# EasyEDA schematic SCH_VTOL-FC_2024-12-10.json
TITLE: VTOL FC; REV: 1.0.0; Sheet: 1/1
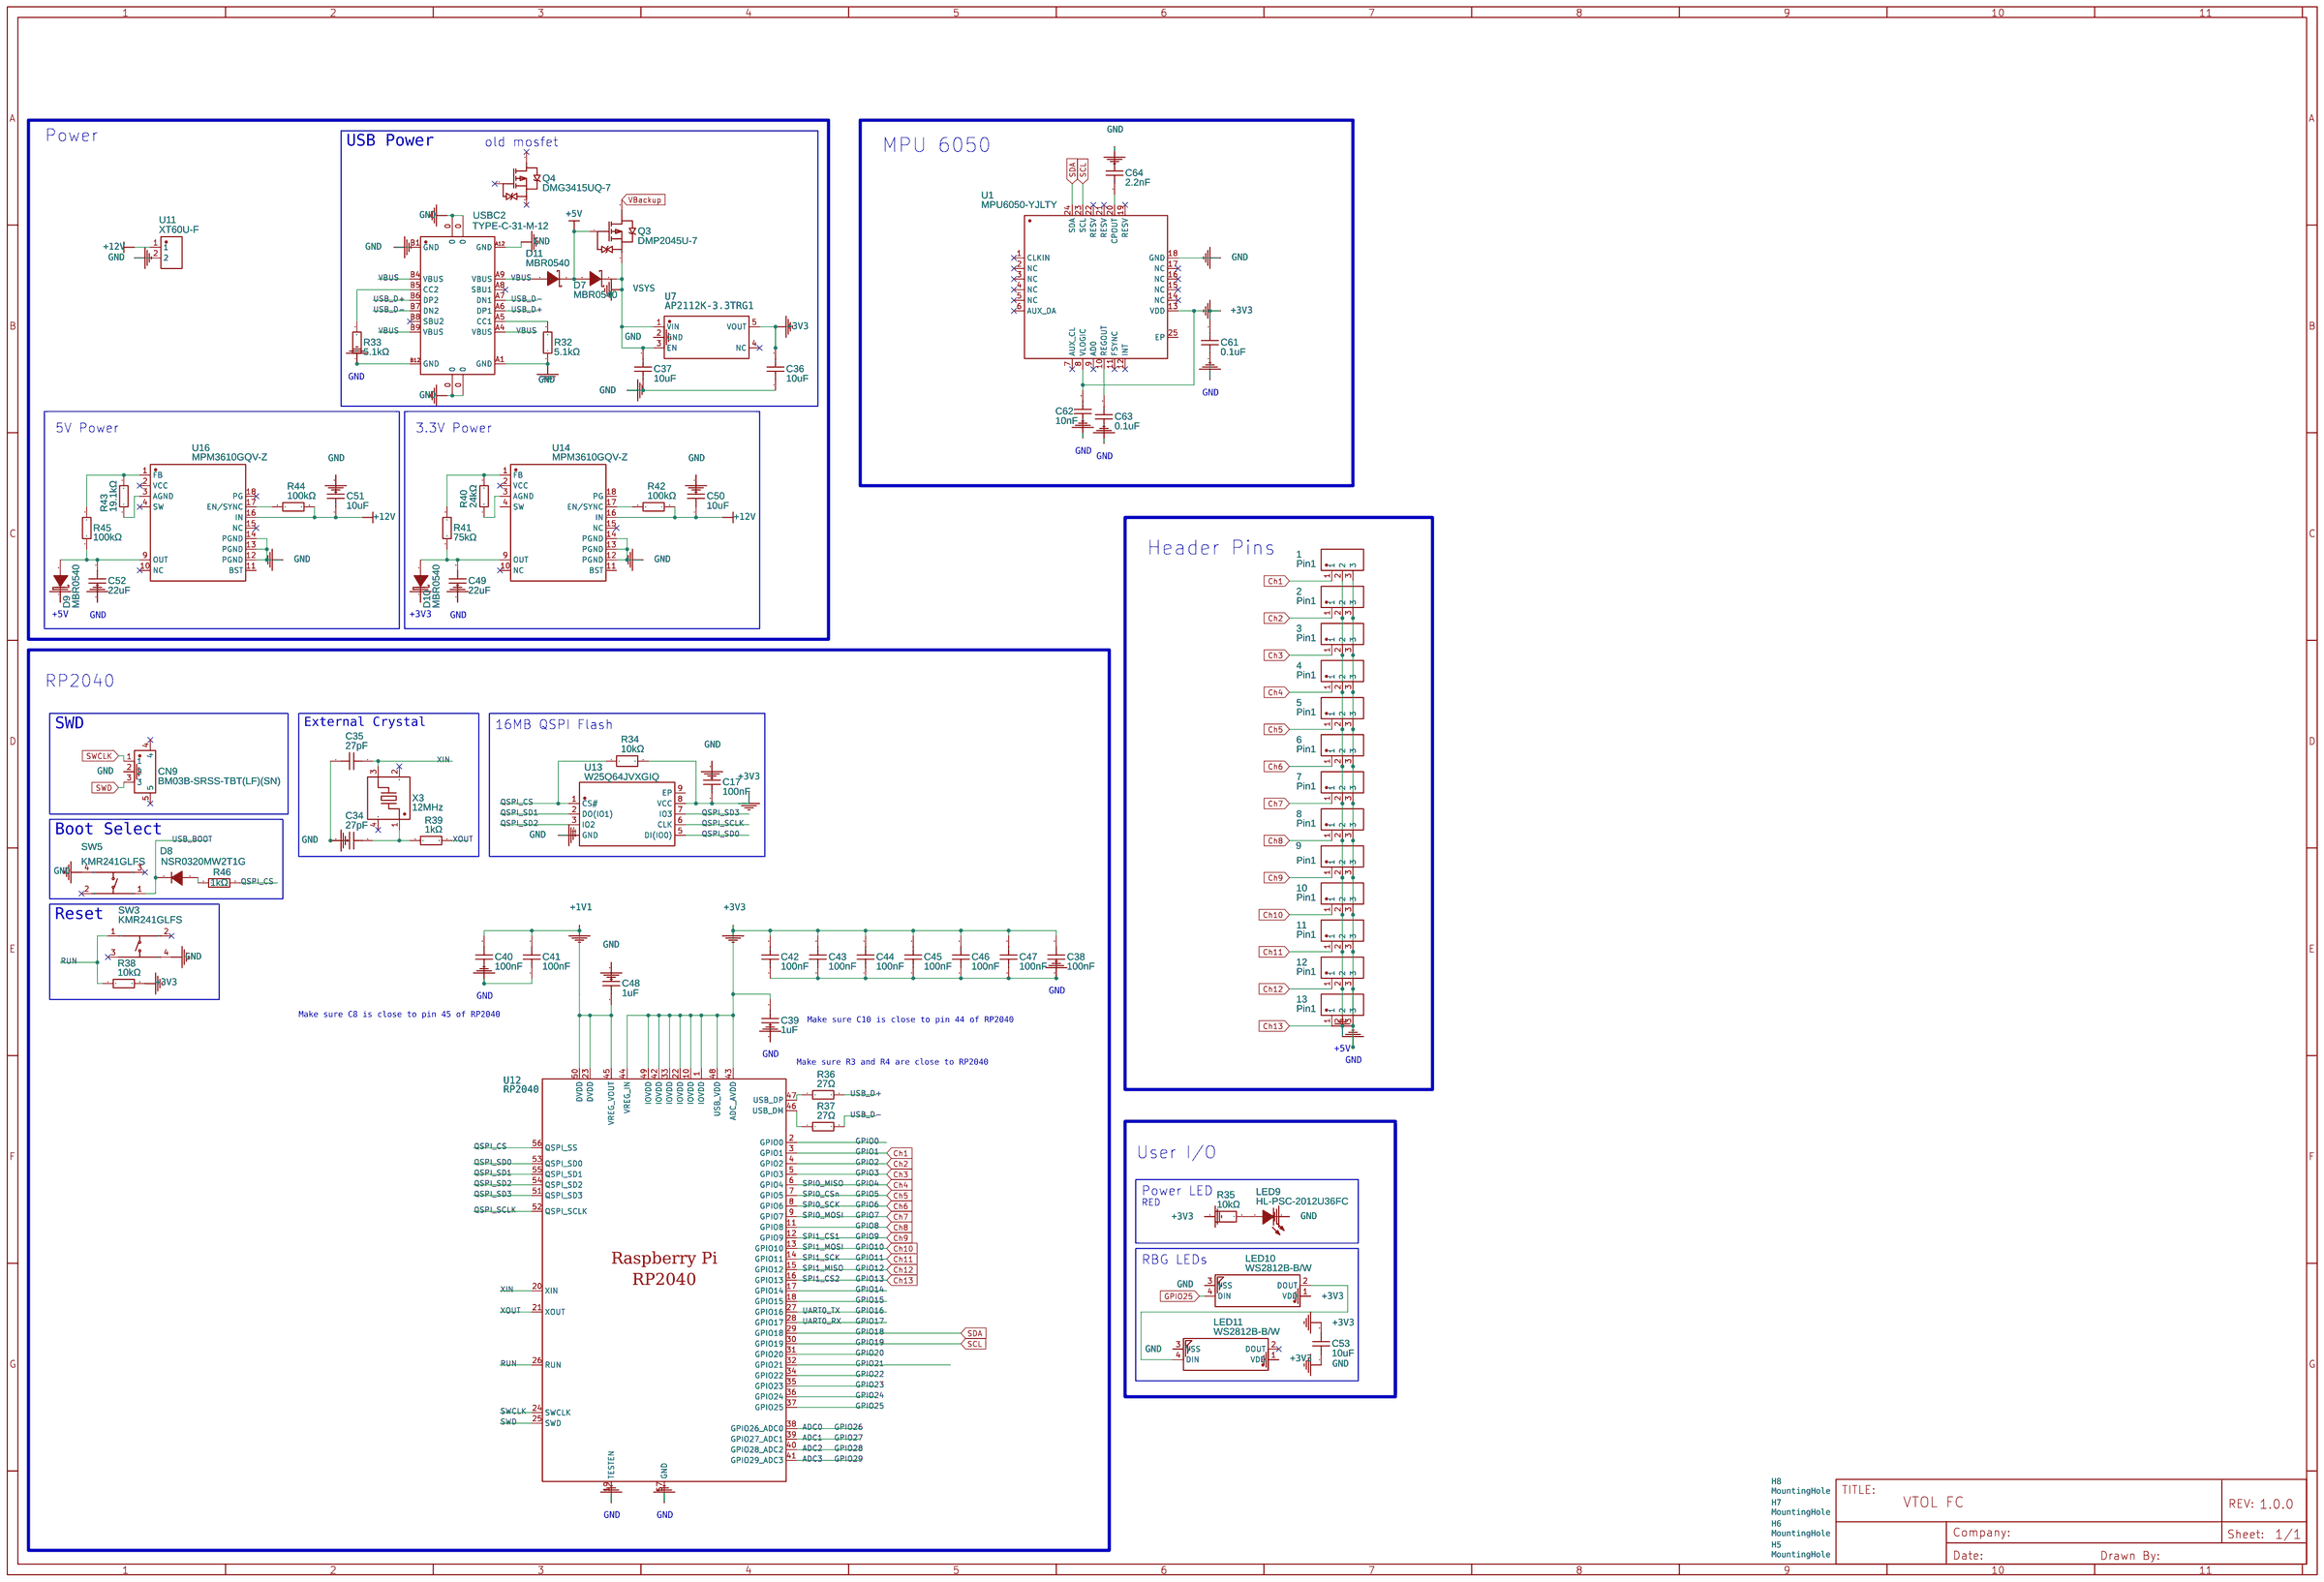
[diagram p0: schematic sheet]

## Parts
1  Pin1  [HDR-TH_3P-P2.54-V-M]
2  Pin1  [HDR-TH_3P-P2.54-V-M]
3  Pin1  [HDR-TH_3P-P2.54-V-M]
4  Pin1  [HDR-TH_3P-P2.54-V-M]
5  Pin1  [HDR-TH_3P-P2.54-V-M]
6  Pin1  [HDR-TH_3P-P2.54-V-M]
7  Pin1  [HDR-TH_3P-P2.54-V-M]
8  Pin1  [HDR-TH_3P-P2.54-V-M]
9  Pin1  [HDR-TH_3P-P2.54-V-M]
10  Pin1  [HDR-TH_3P-P2.54-V-M]
11  Pin1  [HDR-TH_3P-P2.54-V-M]
12  Pin1  [HDR-TH_3P-P2.54-V-M]
13  Pin1  [HDR-TH_3P-P2.54-V-M]
C17  100nF  [C0402]
C34  27pF  [C0402]
C35  27pF  [C0402]
C36  10uF  [C0603]
C37  10uF  [C0603]
C38  100nF  [C0402]
C39  1uF  [C0402]
C40  100nF  [C0402]
C41  100nF  [C0402]
C42  100nF  [C0402]
C43  100nF  [C0402]
C44  100nF  [C0402]
C45  100nF  [C0402]
C46  100nF  [C0402]
C47  100nF  [C0402]
C48  1uF  [C0402]
C49  22uF  [C0603]
C50  10uF  [C0603]
C51  10uF  [C0603]
C52  22uF  [C0603]
C53  10uF  [C0603]
C61  0.1uF  [C0603]
C62  10nF  [C0603]
C63  0.1uF  [C0603]
C64  2.2nF  [C0603]
CN9  BM03B-SRSS-TBT(LF)(SN)  [CONN-SMD_BM03B-SRSS-TBT-LF-SN]
D7  MBR0540  [SOD-123FL_L2.7-W1.8-LS3.8-RD]
D8  NSR0320MW2T1G  [SOD-323_L1.8-W1.3-LS2.5-RD]
D9  MBR0540  [SOD-123FL_L2.7-W1.8-LS3.8-RD]
D10  MBR0540  [SOD-123FL_L2.7-W1.8-LS3.8-RD]
D11  MBR0540  [SOD-123FL_L2.7-W1.8-LS3.8-RD]
H5  MountingHole  [MOUNTINGHOLE_2.7MM_M2.5]
H6  MountingHole  [MOUNTINGHOLE_2.7MM_M2.5]
H7  MountingHole  [MOUNTINGHOLE_2.7MM_M2.5]
H8  MountingHole  [MOUNTINGHOLE_2.7MM_M2.5]
LED9  HL-PSC-2012U36FC  [LED0805-RD_RED]
LED10  WS2812B-B/W  [LED-SMD_4P-L5.0-W5.0-TL_WS2812B-B]
LED11  WS2812B-B/W  [LED-SMD_4P-L5.0-W5.0-TL_WS2812B-B]
Q3  DMP2045U-7  [SOT-23-3_L2.9-W1.3-P1.90-LS2.4-BR-CW]
Q4  DMG3415UQ-7  [SOT-23-3_L2.9-W1.6-P1.90-LS2.8-BR]
R32  5.1kΩ  [R0603]
R33  5.1kΩ  [R0603]
R34  10kΩ  [R0603]
R35  10kΩ  [R0603]
R36  27Ω  [R0402]
R37  27Ω  [R0402]
R38  10kΩ  [R0603]
R39  1kΩ  [R0603]
R40  24kΩ  [R0603]
R41  75kΩ  [R0603]
R42  100kΩ  [R0603]
R43  19.1kΩ  [R0603]
R44  100kΩ  [R0603]
R45  100kΩ  [R0603]
R46  1kΩ  [R0603]
SW3  KMR241GLFS  [KEY-SMD_4P-L4.2-W2.8-P1.60-LS4.6]
SW5  KMR241GLFS  [KEY-SMD_4P-L4.2-W2.8-P1.60-LS4.6]
U1  MPU6050-YJLTY  [QFN-24_L4.0-W4.0-P0.50-BL-EP2.7]
U7  AP2112K-3.3TRG1  [SOT-25-5_L3.0-W1.8-P0.95-LS3.0-BR]
U11  XT60U-F  [CONN-TH_XT60U-F]
U12  RP2040  [LQFN-56_L7.0-W7.0-P0.4-EP]
U13  W25Q64JVXGIQ  [XSON-8_L4.0-W4.0-P0.80-TL-EP]
U14  MPM3610GQV-Z  [QFN-20_L5.0-W3.0-TL-MPM3610GQV-Z]
U16  MPM3610GQV-Z  [QFN-20_L5.0-W3.0-TL-MPM3610GQV-Z]
USBC2  TYPE-C-31-M-12  [USB-C_SMD-TYPE-C-31-M-12]
X3  12MHz  [CRYSTAL-SMD_4P-L3.2-W2.5-BL]

## Library data of the parts
1-13 = 5-146277-3: Supplier: LCSC; Supplier Part: C3327863; Manufacturer: TE Connectivity(泰科电子); Contributor: lcsc
C17 C38 C40-C47 = GCM155R71C104KA55D: Supplier: LCSC; Manufacturer: muRata(村田); Supplier Part: C85857; JLCPCB Part Class: Extended Part
C34 C35 = GJM1555C1H270JB01D: Supplier: LCSC; Manufacturer: muRata(村田); Supplier Part: C88884; JLCPCB Part Class: Extended Part
C36 C37 C50 C51 C53 = CSA0603X5R106M6R3JT: Contributor: lcsc; Supplier: LCSC; Supplier Part: C3015157; Manufacturer: HRE(芯声); JLCPCB Part Class: Extended Part
C39 C48 = TCC0402X5R105K100AT: Contributor: LCSC; Supplier: LCSC; Supplier Part: C380293; Manufacturer: CCTC(三环); JLCPCB Part Class: Extended Part
C49 C52 = CL10A226MQ8NRNC: Supplier: LCSC; Manufacturer: SAMSUNG(三星); Supplier Part: C59461; JLCPCB Part Class: Basic Part
C61-C64 = 0603_C9900021180: Contributor: lcsc; Supplier: LCSC; Supplier Part: C9900021180; Manufacturer: null; Manufacturer Part: 0603; JLCPCB Part Class: Extended Part
CN9 = BM03B-SRSS-TBT(LF)(SN): Contributor: LCSC; Supplier: LCSC; Supplier Part: C495538; Manufacturer: JST; JLCPCB Part Class: Extended Part
D7 D9-D11 = MBR0540: Contributor: LCSC; Supplier: LCSC; Supplier Part: C116159; Manufacturer: SHIKUES(时科); JLCPCB Part Class: Extended Part
D8 = NSR0320MW2T1G: Supplier: LCSC; Manufacturer: onsemi(安森美); Supplier Part: C48192; JLCPCB Part Class: Extended Part
LED9 = HL-PSC-2012U36FC: Contributor: LCSC; Supplier: LCSC; Supplier Part: C497949; Manufacturer: HONGLITRONIC(鸿利光电); JLCPCB Part Class: Extended Part
LED10 LED11 = WS2812B-B/W: Contributor: LCSC; Supplier: LCSC; Supplier Part: C2761795; Manufacturer: worldsemi; Manufacturer Part: WS2812B-B/T; JLCPCB Part Class: Extended Part
Q3 = DMP2045U-7: Contributor: LCSC; Supplier: LCSC; Supplier Part: C459541; Manufacturer: DIODES(美台); JLCPCB Part Class: Extended Part
Q4 = DMG3415UQ-7: Contributor: LCSC; Supplier: LCSC; Supplier Part: C459537; Manufacturer: DIODES(美台); JLCPCB Part Class: Extended Part
R32 R33 = ARG03DTC5101: Contributor: LCSC; Supplier: LCSC; Supplier Part: C311919; Manufacturer: Viking(光颉); JLCPCB Part Class: Extended Part
R34 R35 = FRC0603F1002TS: Contributor: LCSC; Supplier: LCSC; Supplier Part: C2906982; Manufacturer: FOJAN(富捷); JLCPCB Part Class: Extended Part
R36 R37 = 0402WGJ0270TCE: Supplier: LCSC; Manufacturer: UNI-ROYAL(厚声); Supplier Part: C25156; JLCPCB Part Class: Extended Part
R38 = 0603WAF1002T5E: Supplier: LCSC; Manufacturer: UNI-ROYAL(厚声); Supplier Part: C25804; JLCPCB Part Class: Basic Part
R39 R46 = 0603WAF1001T5E: Supplier: LCSC; Manufacturer: UNI-ROYAL(厚声); Supplier Part: C21190; JLCPCB Part Class: Basic Part
R40 = 0603WAF2402T5E: Supplier: LCSC; Manufacturer: UNI-ROYAL(厚声); Supplier Part: C23352; JLCPCB Part Class: Basic Part
R41 = 0603WAF7502T5E: Supplier: LCSC; Manufacturer: UNI-ROYAL(厚声); Supplier Part: C23242; JLCPCB Part Class: Basic Part
R42 R44 R45 = 0603WAF1003T5E: Supplier: LCSC; Manufacturer: UNI-ROYAL(厚声); Supplier Part: C25803; JLCPCB Part Class: Basic Part
R43 = RMC060319.1K1%N: Contributor: LCSC; Supplier: LCSC; Supplier Part: C269469; Manufacturer: Tyohm(幸亚电阻); JLCPCB Part Class: Extended Part
SW3 SW5 = KMR241GLFS: Contributor: LCSC; Supplier: LCSC; Supplier Part: C221682; Manufacturer: C&K; JLCPCB Part Class: Extended Part
U1 = MPU6050-YJLTY: Contributor: LCSC; Supplier: LCSC; Supplier Part: C2912107; Manufacturer: null; JLCPCB Part Class: Extended Part
U7 = AP2112K-3.3TRG1: Supplier: LCSC; Manufacturer: DIODES; Contributor: LCSC; Supplier Part: C51118; JLCPCB Part Class: Extended Part
U11 = XT60U-F: Supplier: LCSC; Supplier Part: C19191801; Manufacturer: AMASS(艾迈斯); JLCPCB Part Class: Extended Part; Contributor: lcsc
U12 = RP2040: Supplier: LCSC; Supplier Part: C2040; Manufacturer: Raspberry Pi(树莓派); JLCPCB Part Class: Extended Part; Contributor: LCSC
U13 = W25Q64JVXGIQ: Contributor: LCSC; Supplier: LCSC; Supplier Part: C2940195; Manufacturer: WINBOND(华邦); JLCPCB Part Class: Extended Part
U14 U16 = MPM3610GQV-Z: Contributor: lcsc; Supplier: LCSC; Supplier Part: C5183856; Manufacturer: MPS(芯源); JLCPCB Part Class: Extended Part
USBC2 = TYPE-C-31-M-12: Supplier: LCSC; Supplier Part: C165948; Manufacturer: Rectangular Connectors - Contacts; Contributor: LCSC; JLCPCB Part Class: Extended Part
X3 = NX3225SA-12MHZ-STD-CSR-6: Contributor: LCSC; Supplier: LCSC; Supplier Part: C481400; Manufacturer: NDK; Manufacturer Part: NX3225SA-12MHz-STD-CSR-6; JLCPCB Part Class: Extended Part

## Nets
+1V1: C40.2 C41.2 C48.2 U12.23(DVDD) U12.45(VREG_VOUT) U12.50(DVDD)
+3V3: C17.1 C36.2 C38.2 C39.2 C42.2 C43.2 C44.2 C45.2 C46.2 C47.2 C53.2 C61.2 C62.2 D10.1(K) LED10.1(VDD) LED11.1(VDD) R34.2 R35.1 R38.2 U1.8(VLOGIC) U1.13(VDD) U7.5(VOUT) U12.1(IOVDD) U12.10(IOVDD) U12.22(IOVDD) U12.33(IOVDD) U12.42(IOVDD) U12.43(ADC_AVDD) U12.44(VREG_IN) U12.48(USB_VDD) U12.49(IOVDD) U13.8(VCC)
+5V: 1.2 2.2 3.2 4.2 5.2 6.2 7.2 8.2 9.2 10.2 11.2 12.2 13.2 D7.2(A) D9.1(K) D11.1(K) Q3.1(G)
+12V: C50.1 C51.1 R42.1 R44.1 U11.1 U14.16(IN) U16.16(IN)
GND: 1.3 2.3 3.3 4.3 5.3 6.3 7.3 8.3 9.3 10.3 11.3 12.3 13.3 C17.2 C34.1 C35.1 C36.1 C37.1 C38.1 C39.1 C40.1 C41.1 C42.1 C43.1 C44.1 C45.1 C46.1 C47.1 C48.1 C49.1 C50.2 C51.2 C52.1 C53.1 C61.1 C62.1 C63.1 C64.1 CN9.2 LED9.1(C) LED10.3(VSS) LED11.3(VSS) R32.1 R33.1 SW3.4 SW5.4 U1.18(GND) U7.2(GND) U11.2 U12.19(TESTEN) U12.57(GND) U13.4(GND) U14.12(PGND) U14.13(PGND) U14.14(PGND) U16.12(PGND) U16.13(PGND) U16.14(PGND) USBC2.0 USBC2.A1(GND) USBC2.A12(GND) USBC2.B1(GND) USBC2.B12(GND)
VBUS: D11.2(A) USBC2.A4(VBUS) USBC2.A9(VBUS) USBC2.B4(VBUS) USBC2.B9(VBUS)
ADC0: U12.38(GPIO26_ADC0)
ADC1: U12.39(GPIO27_ADC1)
ADC2: U12.40(GPIO28_ADC2)
ADC3: U12.41(GPIO29_ADC3)
Ch1: 1.1 U12.3(GPIO1)
Ch2: 2.1 U12.4(GPIO2)
Ch3: 3.1 U12.5(GPIO3)
Ch4: 4.1 U12.6(GPIO4)
Ch5: 5.1 U12.7(GPIO5)
Ch6: 6.1 U12.8(GPIO6)
Ch7: 7.1 U12.9(GPIO7)
Ch8: 8.1 U12.11(GPIO8)
Ch9: 9.1 U12.12(GPIO9)
Ch10: 10.1 U12.13(GPIO10)
Ch11: 11.1 U12.14(GPIO11)
Ch12: 12.1 U12.15(GPIO12)
Ch13: 13.1 U12.16(GPIO13)
GPIO0: U12.2(GPIO0)
GPIO14: U12.17(GPIO14)
GPIO15: U12.18(GPIO15)
GPIO16: U12.27(GPIO16)
GPIO17: U12.28(GPIO17)
GPIO18: U1.24(SDA) U12.29(GPIO18)
GPIO19: U1.23(SCL) U12.30(GPIO19)
GPIO20: U12.31(GPIO20)
GPIO21: U12.32(GPIO21)
GPIO22: U12.34(GPIO22)
GPIO23: U12.35(GPIO23)
GPIO24: U12.36(GPIO24)
GPIO25: LED10.4(DIN) U12.37(GPIO25)
QSPI_CS: R34.1 R46.2 U12.56(QSPI_SS) U13.1(CS#)
QSPI_SCLK: U12.52(QSPI_SCLK) U13.6(CLK)
QSPI_SD0: U12.53(QSPI_SD0) U13.5(DI(IO0))
QSPI_SD1: U12.55(QSPI_SD1) U13.2(DO(IO1))
QSPI_SD2: U12.54(QSPI_SD2) U13.3(IO2)
QSPI_SD3: U12.51(QSPI_SD3) U13.7(IO3)
RUN: R38.1 SW3.1 U12.26(RUN)
SWCLK: CN9.1 U12.24(SWCLK)
SWD: CN9.3 U12.25(SWD)
USB_BOOT: D8.1(C) SW5.1
USB_D+: R36.2 USBC2.A6(DP1) USBC2.B6(DP2)
USB_D-: R37.2 USBC2.A7(DN1) USBC2.B7(DN2)
VBackup: Q3.2(D)
VSYS: C37.2 D7.1(K) Q3.3(S) U7.1(VIN) U7.3(EN)
XIN: C35.2 U12.20(XIN) X3.3
XOUT: R39.2 U12.21(XOUT)
Net-(C34-2): C34.2 R39.1 X3.1
Net-(C49-2): C49.2 D10.2(A) R41.1 U14.9(OUT)
Net-(C52-2): C52.2 D9.2(A) R45.1 U16.9(OUT)
Net-(C63-2): C63.2 U1.10(REGOUT)
Net-(C64-2): C64.2 U1.20(CPOUT)
Net-(D8-2): D8.2(A) R46.1
Net-(LED9-2): LED9.2(A) R35.2
Net-(LED10-2): LED10.2(DOUT) LED11.4(DIN)
Net-(R32-2): R32.2 USBC2.A5(CC1)
Net-(R33-2): R33.2 USBC2.B5(CC2)
Net-(R36-1): R36.1 U12.47(USB_DP)
Net-(R37-1): R37.1 U12.46(USB_DM)
Net-(R40-1): R40.1 U14.3(AGND)
Net-(R40-2): R40.2 R41.2 U14.1(FB)
Net-(R42-2): R42.2 U14.17(EN/SYNC)
Net-(R43-1): R43.1 U16.3(AGND)
Net-(R43-2): R43.2 R45.2 U16.1(FB)
Net-(R44-2): R44.2 U16.17(EN/SYNC)

Not connected (* = marked no-connect by the designer): CN9 4* 5*; LED11 2(DOUT)*; Q4 1(G)* 2(S)* 3(D)*; SW3 2* 3*; SW5 2* 3*; U1 1(CLKIN)* 2(NC)* 3(NC)* 4(NC)* 5(NC)* 6(AUX_DA)* 7(AUX_CL)* 9(AD0)* 11(FSYNC)* 12(INT)* 14(NC)* 15(NC)* 16(NC)* 17(NC)* 19(RESV)* 21(RESV)* 22(RESV)* 25(EP); U7 4(NC)*; U13 9(EP); U14 2(VCC)* 4(SW) 10(NC)* 11(BST) 15(NC)* 18(PG); U16 2(VCC)* 4(SW)* 10(NC)* 11(BST) 15(NC)* 18(PG)*; USBC2 A8(SBU1)* B8(SBU2)*; X3 2(GND)* 4(GND)*

## Notes on the sheet
- Power
- USB Power
- old mosfet
- MPU 6050
- 5V Power
- 3.3V Power
- Header Pins
- RP2040
- SWD
- External Crystal
- 16MB QSPI Flash
- Boot Select
- Reset
- Make sure C8 is close to pin 45 of RP2040
- Make sure C10 is close to pin 44 of RP2040
- Make sure R3 and R4 are close to RP2040
- User I/O
- Power LED
- RED
- RBG LEDs
